# Altium schematic sheet testpoint.SchDoc
size A4; Author: Mikołaj Pichita; CompanyName: AGH University of Science and Technology; SheetNumber: 6; SheetTotal: 16
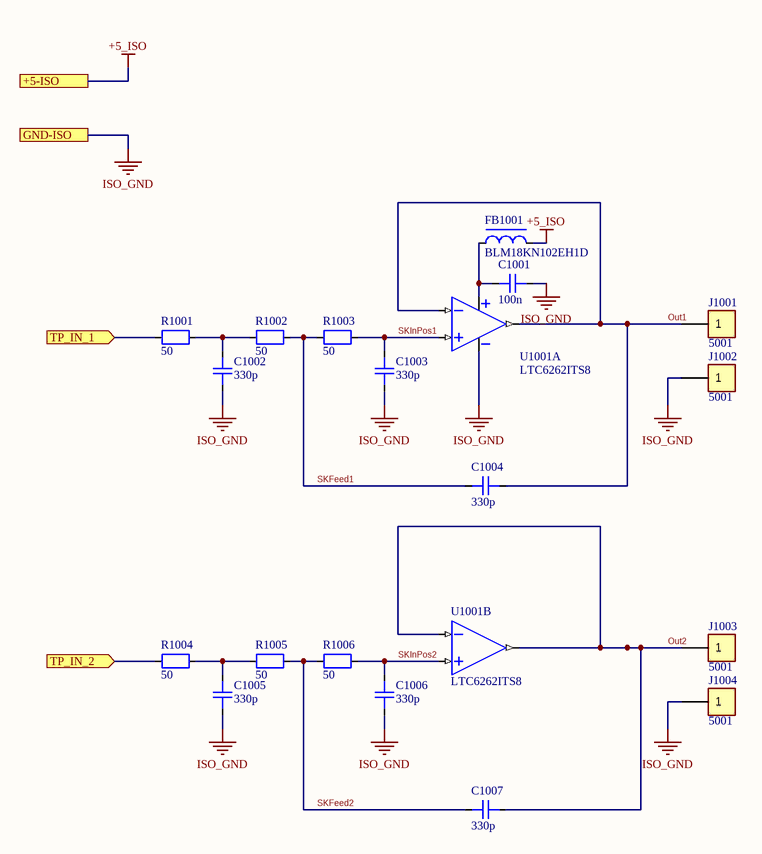
[diagram p0: testpoint.SchDoc]

## Parts
C1001  100n  [CAP0603]
C1002  330p  [CAP0603]
C1003  330p  [CAP0603]
C1004  330p  [CAP0603]
C1005  330p  [CAP0603]
C1006  330p  [CAP0603]
C1007  330p  [CAP0603]
FB1001  BLM18KN102EH1D  [RES0603]
J1001  5001  [FP-5001-MFG]
J1002  5001  [FP-5001-MFG]
J1003  5001  [FP-5001-MFG]
J1004  5001  [FP-5001-MFG]
R1001  50  [RES0603]
R1002  50  [RES0603]
R1003  50  [RES0603]
R1004  50  [RES0603]
R1005  50  [RES0603]
R1006  50  [RES0603]
U1001  LTC6262ITS8  [TSOP65P280X100-8N]  (parts A,B of 2)

## Ports
+5-ISO (see full_bridge[2C], full_bridge[1B], isolator[4B], measurements[1B], OV_OC[1B], power_supply[3B]), GND-ISO (see full_bridge[3C], full_bridge[1B], input_filter[2C], isolator[4B], measurements[1B], output_filter[1B], OV_OC[1B], power_supply[3B], voltage_sense[1A]), TP_IN_1 (in, see full_bridge[2C]), TP_IN_2 (in, see full_bridge[2C])

## Nets
+5_ISO: FB1001.1 ; port +5-ISO
ISO_GND: C1001.2 C1002.2 C1003.2 C1005.2 C1006.2 J1002.1 J1004.1 U1001.4(-V) ; port GND-ISO
Out1: C1004.1 J1001.1 U1001.1(OUTA) U1001.2(-INA)
Out2: C1007.1 J1003.1 U1001.6(-INB) U1001.7(OUTB)
SKFeed1: C1004.2 R1002.1 R1003.2
SKFeed2: C1007.2 R1005.1 R1006.2
SKInPos1: C1003.1 R1003.1 U1001.3(+INB)
SKInPos2: C1006.1 R1006.1 U1001.5(+INB)
TP_IN_1: R1001.2 ; port TP_IN_1
TP_IN_2: R1004.2 ; port TP_IN_2
NetC1001_1: C1001.1 FB1001.2 U1001.8(+V)
NetC1002_1: C1002.1 R1001.1 R1002.2
NetC1005_1: C1005.1 R1004.1 R1005.2

## Notes on the sheet
- Nazwa projektu
- Nazwa dokumentu
- Nazwa firmy:
- Autor:
- Osoba sprawdzająca:
- Data:

## Library data of the parts
C1001-C1007 = Capacitor: Value: *; HelpURL: *; MPN: *; Supplier: *; SupplierPartNumber: *
  C1001: Supplier 1: Mouser; Supplier Part Number 1: 581-06035C104KAT2A
FB1001 = Ferrite Bead: Value: *; HelpURL: *; MPN: *; Supplier: *; SupplierPartNumber: *; Supplier 1: Mouser; Supplier Part Number 1: 81-BLM18KN102EH1D
J1001-J1004 = 5001: PC TEST POINT MINIATURE BLACK; Body Material: Bronze; Plating: Silver; Inside Diameter: 1.27mm; Hole Diameter: 1.6mm; Number of Ports: 1; Outside Diameter: 2.54mm; Insulation: Insulated; Insulation Material: Nylon; Mount: Through Hole; RoHS Compliant: Yes; Series: THM; Height: 0.3inch; Termination: Through Hole; Material: Nylon; Packaging: Bulk; Contact Material: Bronze; REACH SVHC: No SVHC; Contact Plating: Silver; Orientation: Straight; Lead Free: Lead Free; Package Quantity: 100; Length: 7.62mm; Flammability Rating: UL94 V-0; Number of Contacts: 1; Diameter: 2.54mm; Housing Color: Black; Color: Black; Supplier 1: Mouser; Supplier Part Number 1: 534-5001
R1001-R1006 = Resistor: Value: *; HelpURL: *; MPN: *; Supplier: *; SupplierPartNumber: *
U1001 = LTC6262ITS8: Op Amps 2x 30MHz, 240 A Pwr Eff R2R I/O Op Amps; Value: *; HelpURL: *; MPN: *; Supplier: *; SupplierPartNumber: *; Supplier 1: Mouser; Supplier Part Number 1: 584-C6262ITS8TRMPBF